# EAGLE design embededwebcam (EAGLE 8.5.2)
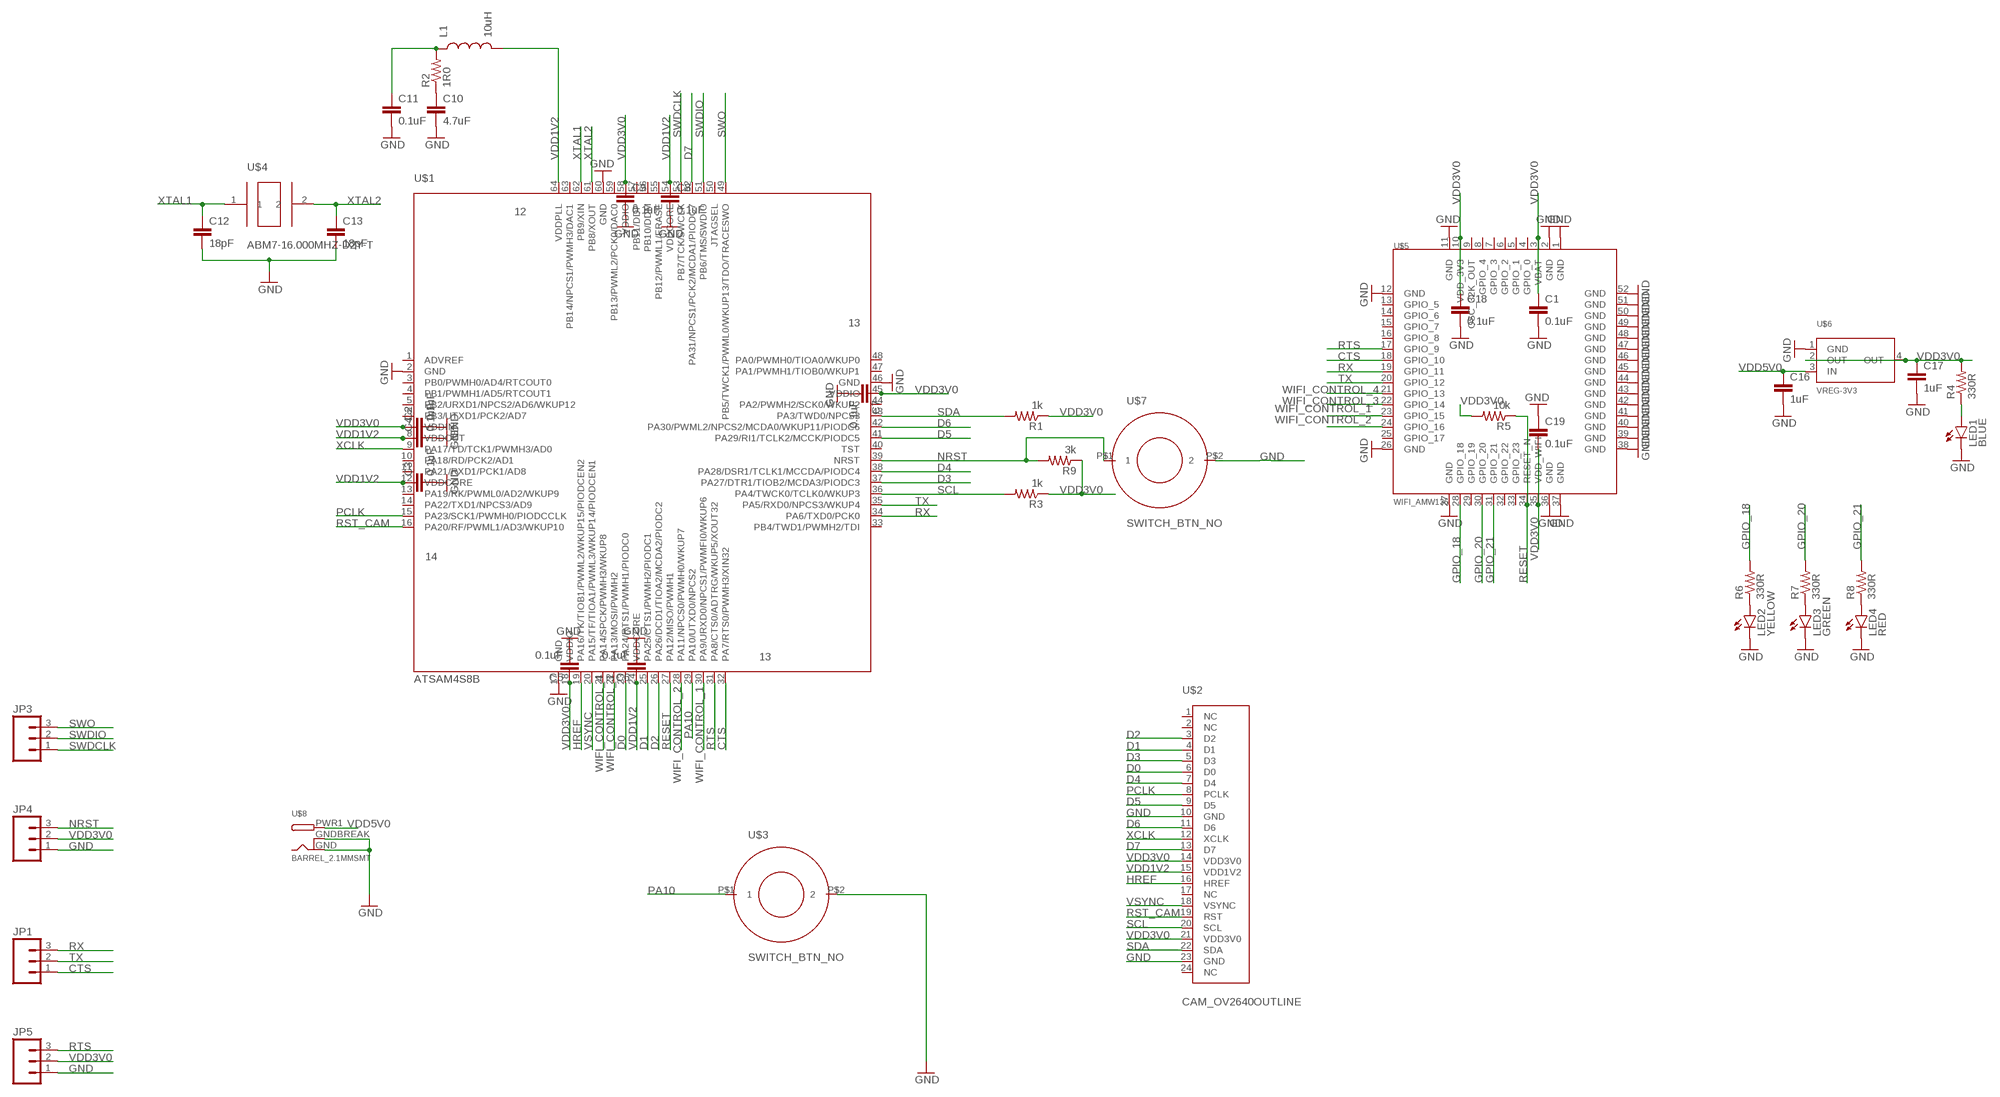
[diagram p0: schematic, sheet 1]

## Parts
C1  0.1uF  CAP  [0805]
C2  0.1uF  CAP0805  [0805]
C3  0.1uF  CAP0805  [0805]
C4  0.1uF  CAP0805  [0805]
C5  0.1uF  CAP0805  [0805]
C6  0.1uF  CAP0805  [0805]
C7  0.1uF  CAP0805  [0805]
C8  0.1uF  CAP0805  [0805]
C9  0.1uF  CAP0805  [0805]
C10  4.7uF  CAP0805  [0805]
C11  0.1uF  CAP0805  [0805]
C12  18pF  CAP0805  [0805]
C13  18pF  CAP0805  [0805]
C16  1uF  CAP  [0805]
C17  1uF  CAP  [0805]
C18  0.1uF  CAP  [0805]
C19  0.1uF  CAP  [0805]
JP1  M03PTH  [1X03]
JP3  M03PTH  [1X03]
JP4  M03PTH  [1X03]
JP5  M03PTH  [1X03]
L1  10uH  INDUCTOR0805  [0805]
LED1  BLUE  LED0603  [LED-0603]
LED2  YELLOW  LED0603  [LED-0603]
LED3  GREEN  LED0603  [LED-0603]
LED4  RED  LED0603  [LED-0603]
R1  1k  RESISTOR0805-RES  [0805]
R2  1R0  RESISTOR0805-RES  [0805]
R3  1k  RESISTOR0805-RES  [0805]
R4  330R  RES  [0805]
R5  10k  RES  [0805]
R6  330R  RES  [0805]
R7  330R  RES  [0805]
R8  330R  RES  [0805]
R9  3k  RESISTOR0805-RES  [0805]
U$1  ATSAM4S8B  [QFP50P1200X1200X160-64N]
U$2  CAM_OV2640OUTLINE  [CAM_CONN]
U$3  SWITCH_BTN_NO  [BTN_2]
U$4  ABM7-16.000MHZ-D2Y-T  [ABM7-16.000MHZ-D2Y-T]
U$5  WIFI_AMW136  [AMW136]
U$6  VREG-3V3  [R-PDSO-G4_TI]
U$7  SWITCH_BTN_NO  [BTN_2]
U$8  BARREL_2.1MMSMT  [DCJACK_2MM_SMT]

## Nets
CTS: JP1.1 U$1.32(PA7/RTS0/PWMH3/XIN32) U$5.18(GPIO_10)
D0: U$1.23(PA24/RTS1/PWMH1/PIODC0) U$2.6(D0)
D1: U$1.25(PA25/CTS1/PWMH2/PIODC1) U$2.4(D1)
D2: U$1.26(PA26/DCD1/TIOA2/MCDA2/PIODC2) U$2.3(D2)
D3: U$1.37(PA27/DTR1/TIOB2/MCDA3/PIODC3) U$2.5(D3)
D4: U$1.38(PA28/DSR1/TCLK1/MCCDA/PIODC4) U$2.7(D4)
D5: U$1.41(PA29/RI1/TCLK2/MCCK/PIODC5) U$2.9(D5)
D6: U$1.42(PA30/PWML2/NPCS2/MCDA0/WKUP11/PIODC6) U$2.11(D6)
D7: U$1.52(PA31/NPCS1/PCK2/MCDA1/PIODC7) U$2.13(D7)
GND: C1.2 C2.2 C3.2 C4.2 C5.2 C6.2 C7.2 C8.2 C9.2 C10.2 C11.2 C12.2 C13.2 C16.2 C17.2 C18.2 C19.1 JP4.1 JP5.1 LED1.C LED2.C LED3.C LED4.C U$1.2(GND) U$1.17(GND) U$1.46(GND) U$1.60(GND) U$2.10(GND) U$2.23(GND) U$3.P$2 U$5.1(GND) U$5.2(GND) U$5.11(GND) U$5.12(GND) U$5.26(GND) U$5.27(GND) U$5.36(GND) U$5.37(GND) U$5.38(GND) U$5.39(GND) U$5.40(GND) U$5.41(GND) U$5.42(GND) U$5.43(GND) U$5.44(GND) U$5.45(GND) U$5.46(GND) U$5.47(GND) U$5.48(GND) U$5.49(GND) U$5.50(GND) U$5.51(GND) U$5.52(GND) U$6.1(GND) U$7.P$2 U$8.GND U$8.GNDBREAK
GPIO_18: R6.2 U$5.28(GPIO_18)
GPIO_20: R7.2 U$5.30(GPIO_20)
GPIO_21: R8.2 U$5.31(GPIO_21)
HREF: U$1.19(PA16/TK/TIOB1/PWML2/WKUP15/PIODCEN2) U$2.16(HREF)
N$2: C11.1 L1.1 R2.2
N$3: C10.1 R2.1
N$4: LED1.A R4.1
N$46: LED2.A R6.1
N$52: LED3.A R7.1
N$53: LED4.A R8.1
NRST: JP4.3 R9.2 U$1.39(NRST) U$7.P$1
PA10: U$1.29(PA10/UTXD0/NPCS2) U$3.P$1
PCLK: U$1.15(PA23/SCK1/PWMH0/PIODCCLK) U$2.8(PCLK)
RESET: R5.1 U$1.27(PA12/MISO/PWMH1) U$5.34(RESET_N)
RST_CAM: U$1.16(PA20/RF/PWML1/AD3/WKUP10) U$2.19(RST)
RTS: JP5.3 U$1.31(PA8/CTS0/ADTRG/WKUP5/XOUT32) U$5.17(GPIO_9)
RX: JP1.3 U$1.34(PA6/TXD0/PCK0) U$5.19(GPIO_11)
SCL: R3.2 U$1.36(PA4/TWCK0/TCLK0/WKUP3) U$2.20(SCL)
SDA: R1.2 U$1.43(PA3/TWD0/NPCS3) U$2.22(SDA)
SWDCLK: JP3.1 U$1.53(PB7/TCK/SWCLK)
SWDIO: JP3.2 U$1.51(PB6/TMS/SWDIO)
SWO: JP3.3 U$1.49(PB5/TWCK1/PWML0/WKUP13/TDO/TRACESWO)
TX: JP1.2 U$1.35(PA5/RXD0/NPCS3/WKUP4) U$5.20(GPIO_12)
VDD1V2: C3.1 C4.1 C6.1 C8.1 L1.2 U$1.8(VDDOUT) U$1.12(VDDCORE) U$1.24(VDDCORE) U$1.54(VDDCORE) U$1.64(VDDPLL) U$2.15(VDD1V2)
VDD3V0: C1.1 C2.1 C5.1 C7.1 C9.1 C17.1 C18.1 C19.2 JP4.2 JP5.2 R1.1 R3.1 R4.2 R5.2 R9.1 U$1.7(VDDIN) U$1.18(VDDIO) U$1.45(VDDIO) U$1.58(VDDIO) U$2.14(VDD3V0) U$2.21(VDD3V0) U$5.3(VBAT) U$5.10(VDD_3V3) U$5.35(VDD_WIFI) U$6.2(OUT) U$6.4(OUT)
VDD5V0: C16.1 U$6.3(IN) U$8.PWR1(PWR)
VSYNC: U$1.20(PA15/TF/TIOA1/PWML3/WKUP14/PIODCEN1) U$2.18(VSYNC)
WIFI_CONTROL_1: U$1.30(PA9/URXD0/NPCS1/PWMFI0/WKUP6) U$5.24(GPIO_16)
WIFI_CONTROL_2: U$1.28(PA11/NPCS0/PWMH0/WKUP7) U$5.23(GPIO_15)
WIFI_CONTROL_3: U$1.22(PA13/MOSI/PWMH2) U$5.22(GPIO_14)
WIFI_CONTROL_4: U$1.21(PA14/SPCK/PWMH3/WKUP8) U$5.21(GPIO_13)
XCLK: U$1.9(PA17/TD/TCK1/PWMH3/AD0) U$2.12(XCLK)
XTAL1: C12.1 U$1.62(PB9/XIN) U$4.1
XTAL2: C13.1 U$1.61(PB8/XOUT) U$4.2
Unconnected: U$1.1(ADVREF) U$1.3(PB0/PWMH0/AD4/RTCOUT0) U$1.4(PB1/PWMH1/AD5/RTCOUT1) U$1.5(PB2/URXD1/NPCS2/AD6/WKUP12) U$1.6(PB3/UTXD1/PCK2/AD7) U$1.10(PA18/RD/PCK2/AD1) U$1.11(PA21/RXD1/PCK1/AD8) U$1.13(PA19/RK/PWML0/AD2/WKUP9) U$1.14(PA22/TXD1/NPCS3/AD9) U$1.33(PB4/TWD1/PWMH2/TDI) U$1.40(TST) U$1.44(PA2/PWMH2/SCK0/WKUP2) U$1.47(PA1/PWMH1/TIOB0/WKUP1) U$1.48(PA0/PWMH0/TIOA0/WKUP0) U$1.50(JTAGSEL) U$1.55(PB12/PWML1/ERASE) U$1.56(PB10/DDM) U$1.57(PB11/DDP) U$1.59(PB13/PWML2/PCK0/DAC0) U$1.63(PB14/NPCS1/PWMH3/DAC1) U$2.1(NC) U$2.2(NC) U$2.17(NC) U$2.24(NC) U$5.4(GPIO_0) U$5.5(GPIO_1) U$5.6(GPIO_2) U$5.7(GPIO_3) U$5.8(GPIO_4) U$5.9(OSC_32K_OUT) U$5.13(GPIO_5) U$5.14(GPIO_6) U$5.15(GPIO_7) U$5.16(GPIO_8) U$5.25(GPIO_17) U$5.29(GPIO_19) U$5.32(GPIO_22) U$5.33(GPIO_23)

## Notes on the sheet
- 12
- 13
- 14
- 13

## Library data of the parts
C1 C16-C19 = Ilya_Teach:CAP
C2-C13 = SparkFun:CAP: Capacitor Standard 0603 ceramic capacitor, and 0.1" leaded capacitor.
JP1 JP3-JP5 = SparkFun:M03: Header 3 Standard 3-pin 0.1" header. Use with straight break away headers (SKU : PRT-00116), right angle break away headers (PRT-00553), swiss pins (PRT-00743), machine pins (PRT-00117), and female headers (PRT-00115). Molex polarized connector foot print use with SKU : PRT-08232 with associated crimp pins and housings.
L1 = SparkFun:INDUCTOR: Inductors Basic Inductor/Choke - 0603 and 1206. Footprints are not proven and vary greatly between part numbers.
LED1-LED4 = Ilya_Teach:LED: LEDs Standard schematic elements and footprints for 5mm, 3mm, 1206, and 0603 sized LEDs. 5mm - Spark Fun Electronics SKU : COM-00529 (and others)
R1-R3 R9 = SparkFun:RESISTOR: Resistor Basic schematic elements and footprints for 0603, 1206, and PTH resistors.
R4-R8 = Ilya_Teach:RES
U$1 = Ilya:ATSAM4S8B
U$2 = Ilya_Teach:CAM_OV2640
U$3 U$7 = Ilya_Teach:SWITCH_BTN_NO
U$4 = Ilya:ABM7-16.000MHZ-D2Y-T
U$5 = Ilya_Teach:WIFI_AMW136
U$6 = Ilya_Teach:VREG-3V3
U$8 = Ilya_Teach:BARREL_2.1MM

## Board
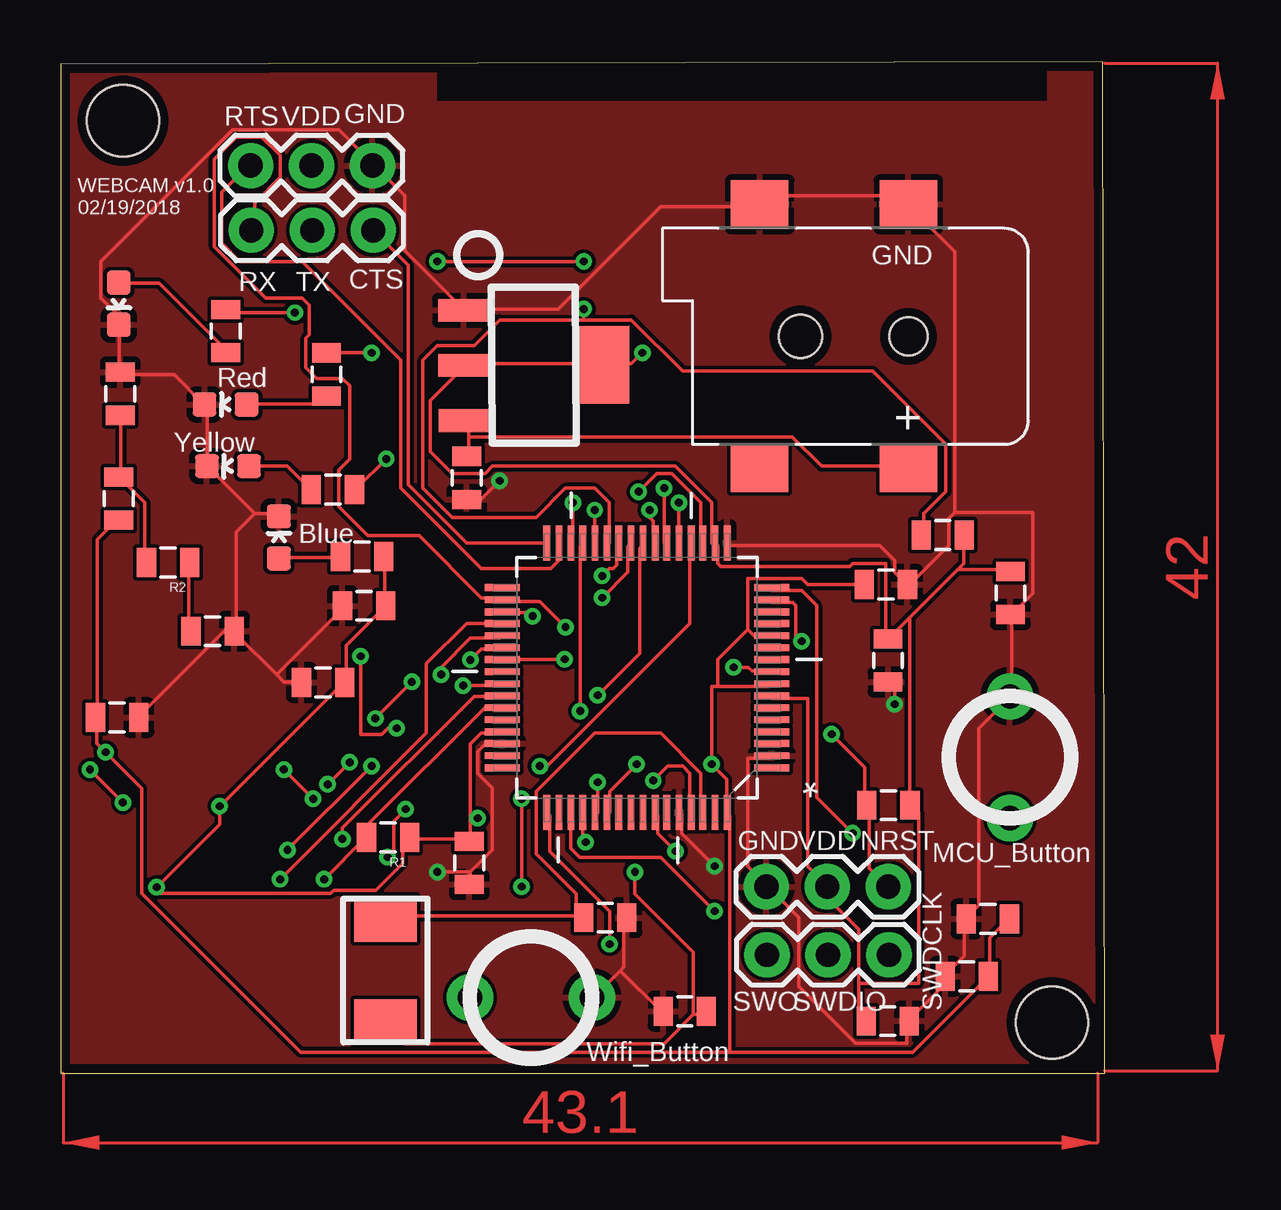
[diagram p1: board, top side]
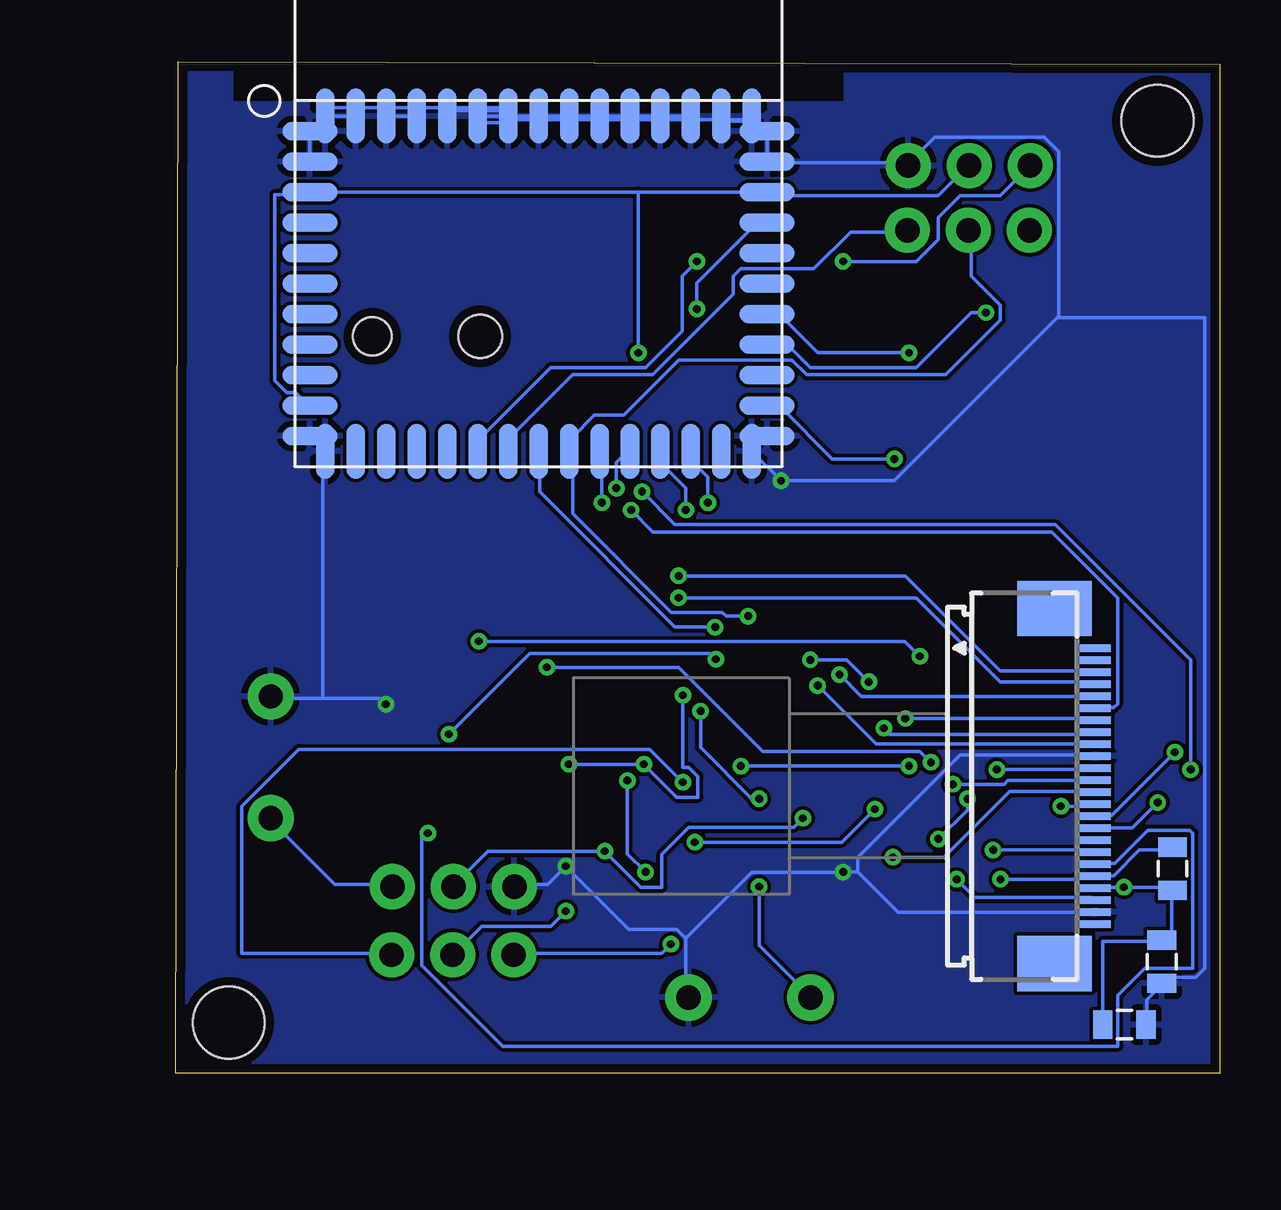
[diagram p2: board, bottom side, seen from below]

Size 43.51 x 42.16 mm. Coordinates in mm from the lower left corner, seen from the top.
Outline: 0,0 43.51,0 43.41,42.16 0,42.06 0,0
Copper layers (1*16): Top 0.0356mm / dielectric 1.5011mm / Bottom 0.0356mm
Design rules "LaenPCBOrder": minimum track width 6mil, minimum drill 13mil, track to track 6mil, track to pad 6mil, pad to pad 6mil, via to via 6mil, smd to smd 6mil, copper to edge 15mil, drill to drill 6mil, minimum pad ring 7mil, minimum via ring 7mil, stop-mask expansion 3mil, vias tented up to drill 0mil, thermal gap 10mil
Holes 3 mm at 2.6,39.7 41.3,2.1

### Footprints (pad centres in the part's own frame; a part is rotated, then mirrored left to right if it is on the bottom)
0805 = smd 0.8 x 1.2: 1 -0.9,0; 2 0.9,0
1X03 = drill 1.016 pad 1.88: 1 0,0; 2 2.54,0; 3 5.08,0
LED-0603 = smd 1 x 1: A 0,-0.877; C 0,0.877
QFP50P1200X1200X160-64N = smd 1.473 x 0.279: 1 -5.613,3.759; 2 -5.613,3.251; 3 -5.613,2.743; 4 -5.613,2.261; 5 -5.613,1.753; 6 -5.613,1.245; 7 -5.613,0.762; 8 -5.613,0.254; 9 -5.613,-0.254; 10 -5.613,-0.762; 11 -5.613,-1.245; 12 -5.613,-1.753; 13 -5.613,-2.261; 14 -5.613,-2.743; 15 -5.613,-3.251; 16 -5.613,-3.759; 33 5.613,-3.759; 34 5.613,-3.251; 35 5.613,-2.743; 36 5.613,-2.261; 37 5.613,-1.753; 38 5.613,-1.245; 39 5.613,-0.762; 40 5.613,-0.254; 41 5.613,0.254; 42 5.613,0.762; 43 5.613,1.245; 44 5.613,1.753; 45 5.613,2.261; 46 5.613,2.743; 47 5.613,3.251; 48 5.613,3.759 | smd 0.279 x 1.473: 17 -3.759,-5.613; 18 -3.251,-5.613; 19 -2.743,-5.613; 20 -2.261,-5.613; 21 -1.753,-5.613; 22 -1.245,-5.613; 23 -0.762,-5.613; 24 -0.254,-5.613; 25 0.254,-5.613; 26 0.762,-5.613; 27 1.245,-5.613; 28 1.753,-5.613; 29 2.261,-5.613; 30 2.743,-5.613; 31 3.251,-5.613; 32 3.759,-5.613; 49 3.759,5.613; 50 3.251,5.613; 51 2.743,5.613; 52 2.261,5.613; 53 1.753,5.613; 54 1.245,5.613; 55 0.762,5.613; 56 0.254,5.613; 57 -0.254,5.613; 58 -0.762,5.613; 59 -1.245,5.613; 60 -1.753,5.613; 61 -2.261,5.613; 62 -2.743,5.613; 63 -3.251,5.613; 64 -3.759,5.613
CAM_CONN = smd 0.3 x 1.3: 1 -5.75,3.25; 2 -5.25,3.25; 3 -4.75,3.25; 4 -4.25,3.25; 5 -3.75,3.25; 6 -3.25,3.25; 7 -2.75,3.25; 8 -2.25,3.25; 9 -1.75,3.25; 10 -1.25,3.25; 11 -0.75,3.25; 12 -0.25,3.25; 13 0.25,3.25; 14 0.75,3.25; 15 1.25,3.25; 16 1.75,3.25; 17 2.25,3.25; 18 2.75,3.25; 19 3.25,3.25; 20 3.75,3.25; 21 4.25,3.25; 22 4.75,3.25; 23 5.25,3.25; 24 5.75,3.25 | smd 2.3 x 3.1: P1 -7.4,1.55; P2 7.4,1.55
BTN_2 = drill 1.016 pad 1.93: P$1 -2.54,0; P$2 2.54,0
ABM7-16.000MHZ-D2Y-T = smd 1.9 x 2.6: 1 -2.15,0; 2 2.15,0
AMW136 = smd 0.762 x 2.286: 1 6.35,9.525; 2 5.08,9.525; 3 3.81,9.525; 4 2.54,9.525; 5 1.27,9.525; 6 0,9.525; 7 -1.27,9.525; 8 -2.54,9.525; 9 -3.81,9.525; 10 -5.08,9.525; 11 -6.35,9.525; 27 -6.35,-9.525; 28 -5.08,-9.525; 29 -3.81,-9.525; 30 -2.54,-9.525; 31 -1.27,-9.525; 32 0,-9.525; 33 1.27,-9.525; 34 2.54,-9.525; 35 3.81,-9.525; 36 5.08,-9.525; 37 6.35,-9.525 | smd 2.286 x 0.762: 12 -6.985,8.89; 13 -6.985,7.62; 14 -6.985,6.35; 15 -6.985,5.08; 16 -6.985,3.81; 17 -6.985,2.54; 18 -6.985,1.27; 19 -6.985,0; 20 -6.985,-1.27; 21 -6.985,-2.54; 22 -6.985,-3.81; 23 -6.985,-5.08; 24 -6.985,-6.35; 25 -6.985,-7.62; 26 -6.985,-8.89; 38 6.985,-8.89; 39 6.985,-7.62; 40 6.985,-6.35; 41 6.985,-5.08; 42 6.985,-3.81; 43 6.985,-2.54; 44 6.985,-1.27; 45 6.985,0; 46 6.985,1.27; 47 6.985,2.54; 48 6.985,3.81; 49 6.985,5.08; 50 6.985,6.35; 51 6.985,7.62; 52 6.985,8.89
R-PDSO-G4_TI = smd 0.95 x 2.15: 1 -2.3,-2.9; 2 0,-2.9; 3 2.3,-2.9 | smd 3.25 x 2.15: 4 0,2.9
DCJACK_2MM_SMT = smd 2.4 x 2: GND -2.54,-5.5; GNDBREAK 3.66,-5.5; PWR1 -2.54,5.5; PWR2 3.66,5.5 | hole 1.6: -2.54,0 | hole 1.8: 1.96,0

### Placement (x,y rotation side)
C1  34.47,17.2 270 top
C2  39.57,20.01 270 top
C3  34.38,20.37 0 top
C4  38.63,6.43 180 top
C5  34.46,2.17 0 top
C6  37.75,4.03 180 top
C7  12.64,19.48 180 top
C8  2.35,14.82 0 top
C9  17.02,8.76 270 top
C10  6.33,18.42 0 top
C11  2.48,28.32 90 top
C12  22.69,6.48 0 top
C13  26,2.58 180 top
C16  16.92,24.81 270 top
C17  3.98,2.02 0 bottom
C18  10.93,16.28 180 top
C19  2.42,4.64 90 bottom
JP1  13.02,35.13 180 top
JP3  34.51,4.93 180 top
JP4  29.4,7.77 0 top
JP5  12.99,37.83 180 top
L1  2.42,23.95 270 top
LED1  9.09,22.33 0 top
LED2  6.97,25.3 90 top
LED3  2.42,32.07 180 top
LED4  6.87,27.87 90 top
R1  13.64,9.82 180 top
R2  4.47,21.28 180 top
R3  1.98,8.52 90 bottom
R4  12.56,21.53 0 top
R5  36.75,22.43 0 top
R6  11.34,24.33 0 top
R7  6.87,30.93 90 top
R8  11.07,29.12 90 top
R9  34.49,11.17 180 top
U$1  24.01,16.48 180 top
U$2  8.45,11.96 270 bottom
U$3  19.6,3.15 0 top
U$4  13.53,4.28 270 top
U$5  28.39,32.91 90 bottom
U$6  19.71,29.51 270.2 top
U$7  39.55,13.16 90 top
U$8  32.78,30.71 180 top

### Tracks (layer width: path | path; a pad name or v marks a point on that pad's centre or on a via)
CTS
  Top 0.152: U$1.32 20.12,22.1 16.92,22.1 14.48,24.54 14.48,33.68 13.11,35.05 JP1.1
  Bottom 0.152: U$5.18 29.57,26.06 29.57,26.52 26.98,29.11 23.62,29.11 20.27,32.46 20.27,33.22 19.96,33.53 16.92,33.53 15.39,35.05 13.11,35.05 JP1.1
D0  (via drill 0.33)
  Top 0.152: v24.54,23.47 24.54,23.16 24.69,23.01 24.69,22.1 U$1.23
  Bottom 0.152: v24.54,23.47 23.62,22.55 7.01,22.55 4.27,19.81 4.27,15.39 4.42,15.24 5.18,15.24 U$2.6
D1  (via drill 0.33)
  Top 0.152: v22.55,19.81 23.62,20.88 23.62,21.95 U$1.25
  Bottom 0.152: v22.55,19.81 12.65,19.81 9.14,16.31 5.33,16.31 U$2.4
D2  (via drill 0.33)
  Top 0.152: v22.55,20.73 22.86,21.03 23.01,21.03 23.16,21.18 23.16,21.95 U$1.26
  Bottom 0.152: v22.55,20.73 13.11,20.73 9.14,16.76 5.33,16.76 U$2.3
D3  (via drill 0.33)
  Top 0.152: v15.85,16.61 15.85,16.92 17.07,18.14 18.29,18.14 U$1.37
  Bottom 0.152: v15.85,16.61 14.94,15.7 5.33,15.7 U$2.5
D4  (via drill 0.33)
  Top 0.152: v14.63,16.31 v13.11,14.78 | v17.07,17.22 17.53,17.68 18.29,17.68 U$1.38
  Bottom 0.152: v13.11,14.78 5.33,14.78 U$2.7 | v14.63,16.31 15.54,17.22 v17.07,17.22
D5  (via drill 0.33)
  Top 0.152: v16.76,16.15 18.29,16.15 U$1.41
  Bottom 0.152: v16.76,16.15 14.33,13.72 5.33,13.72 U$2.9
D6  (via drill 0.33)
  Top 0.152: v10.52,11.43 v9.3,12.65 | v11.73,9.75 11.73,10.21 17.22,15.7 18.29,15.7 U$1.42
  Bottom 0.152: v9.3,12.65 5.33,12.65 U$2.11 | v10.52,11.43 10.52,10.97 v11.73,9.75
D7  (via drill 0.33)
  Top 0.152: v13.62,9 13.88,9.25 13.88,10.5 v14.38,11 | v21.88,9.62 21.75,9.75 21.75,10.75 U$1.52
  Bottom 0.152: v13.62,9 11.5,9 8.75,11.75 5.25,11.75 U$2.13 | v14.38,11 15.75,9.62 v21.88,9.62
GND  (via drill 0.33)
  Top 0.152: 25.76,11.5 25.75,11.5 U$1.60 25.88,10.75 25.88,10 v27.25,8.62 | 17,23.88 C16.2 17.07,23.93 17.53,23.93 v18.29,24.69 | 23.32,4.27 22.25,3.2 U$3.P$2 | 23.32,4.27 23.47,4.42 23.47,6.4 C12.2 | 23.32,4.27 24.99,2.59 C13.2 | 17.07,8.38 17.07,7.92 C9.2 | 17.07,8.38 17.98,9.3 17.98,11.89 17.37,12.5 17.37,13.41 17.68,13.72 18.29,13.72 U$1.46 | v15.7,8.38 17.07,8.38 | 8.99,16.61 7.32,18.29 C10.2 | 8.99,16.61 9.3,16.31 9.91,16.31 C18.2 | 8.99,16.61 11.73,19.36 C7.2 | 8.08,23.32 8.99,23.32 LED1.C | 8.08,23.32 LED2.C 6.1,25.45 6.1,27.74 LED4.C 5.94,27.89 4.72,29.11 2.59,29.11 C11.2 2.44,29.26 2.44,31.09 LED3.C 2.29,31.24 2.29,31.7 1.68,32.31 1.68,33.83 7.16,39.32 11.58,39.32 12.95,37.95 JP5.1 13.11,37.8 14.33,36.58 14.33,34.29 16.76,31.85 U$6.1 16.92,31.85 20.73,31.85 24.99,36.12 29.11,36.12 U$8.GNDBREAK 29.26,36.27 30.02,36.27 30.33,36.58 34.9,36.58 35.2,36.27 U$8.GND 35.38,36.12 37.25,34.25 37.25,23.38 | 8.08,23.32 7.32,22.55 7.32,18.44 C10.2 | C8.2 3.25,14.88 7.25,18.88 C10.2 | U$1.2 29.5,13.12 28.62,13.12 28.62,8.62 29.38,7.88 JP4.1 29.5,7.75 30.75,6.5 30.75,3.62 33.12,1.25 35.25,1.25 35.25,2.12 C5.2 35.38,2.25 36.75,3.62 36.75,4 C6.2 36.88,4.12 37.64,4.88 37.64,6.4 C4.2 37.75,6.5 38.25,7 38.25,14.38 39.5,15.62 U$7.P$2 39.62,15.75 39.62,19 C2.2 39.62,19.12 40.5,20 40.5,23.38 37.25,23.38 | U$1.17 27.88,22 34.12,22 34.75,21.38 34.75,20.88 35.25,20.38 C3.2 35.38,20.38 37,22 37,23.12 37.25,23.38 | v34.75,15.38 34.75,16 34.5,16.25 C1.2
  Bottom 0.152: 19.31,39.69 19,39.38 18.88,39.38 U$5.37 U$5.36 18.75,37.95 13.11,37.95 JP5.1 12.95,37.95 11.89,39.01 7.32,39.01 6.71,38.41 6.71,31.55 | 19.31,39.69 19.5,39.88 | 19.5,39.88 19.62,39.75 22,39.75 | 29.5,39.75 29.62,39.75 29.75,39.62 31,39.62 31.12,39.75 31.12,40.12 | 29.5,39.75 22,39.75 | 31.12,40.12 29.62,40.12 29.62,40.25 33.12,40.25 | 33.12,40.25 37,40.25 37.25,40 U$5.52 | 19.5,39.88 U$5.38 | 29.5,7.75 JP4.1 29.38,7.88 28,7.88 v27.25,8.62 24.62,6 22.62,6 22.25,5.62 | U$5.11 37.88,26.5 37.38,26 U$5.12 37.38,25.88 37.38,15.62 | U$5.2 U$5.1 U$5.52 | U$5.52 U$5.51 | U$5.50 U$5.49 33.12,40.25 | U$5.48 31.97,40.12 31.12,40.12 | U$5.47 29.64,39.9 29.5,39.75 | U$5.46 U$5.45 U$5.44 U$5.43 U$5.42 U$5.41 U$5.40 22,39.75 | U$5.39 20.56,39.69 19.31,39.69 | U$5.27 U$5.26 19.51,25.91 v18.29,24.69 13.56,24.69 6.71,31.55 | C17.2 3.05,2.13 3.05,3.05 2.44,3.66 C19.1 2.38,3.75 2.12,4 1,4 0.62,4.38 0.62,31.5 6.75,31.5 6.71,31.55 | 15.09,8.38 13.41,6.71 5.33,6.71 U$2.23 | 15.09,8.38 15.09,8.99 10.82,13.26 5.33,13.26 U$2.10 | 15.09,8.38 v15.7,8.38 15.75,8.38 19.5,8.38 22.25,5.62 | 22.25,5.62 22.25,3.25 U$3.P$2 | v34.75,15.38 35,15.62 37.38,15.62 | 37.38,15.62 39.5,15.62 U$7.P$2
  pour Bottom: 0.1,0 43.6,0 43.7,-0.1 43.7,42 43.5,42.2 0.3,42.2 0.1,42
  pour Top: 0.3,41.9 0.3,-0.1 0,-0.4 42.9,-0.4 43.5,0.2 43.5,42.2 0.6,42.2
GPIO_18  (via drill 0.33)
  Top 0.152: v13.56,25.6 12.34,24.38 R6.2
  Bottom 0.152: v13.56,25.6 16.15,25.6 18.29,27.74 18.75,27.74 U$5.28
GPIO_20  (via drill 0.33)
  Top 0.152: v9.75,31.7 7.01,31.7 R7.2
  Bottom 0.152: v9.75,31.7 10.36,31.7 12.65,29.41 17.07,29.41 17.98,30.33 18.75,30.33 U$5.30
GPIO_21  (via drill 0.33)
  Top 0.152: v12.95,30.02 11.12,30.02 R8.2
  Bottom 0.152: v12.95,30.02 16.76,30.02 18.29,31.55 18.75,31.55 U$5.31
HREF  (via drill 0.33)
  Top 0.152: v1.22,12.65 v2.59,11.28 | v24.08,24.23 24.84,24.99 25.45,24.99 26.67,23.77 26.67,22.1 U$1.19
  Bottom 0.152: v2.59,11.28 3.66,10.21 5.18,10.21 U$2.16 | v1.22,12.65 1.22,17.22 6.86,22.86 22.71,22.86 v24.08,24.23
N$2
  Top 0.152: C11.1 2.5,27.25 2.5,25 L1.1 2.44,24.84 3.5,23.77 3.5,21.34 R2.2
N$3
  Top 0.152: R2.1 5.33,21.18 5.33,18.44 C10.1
N$4
  Top 0.152: LED1.A 9.14,21.49 11.58,21.49 R4.1
N$46
  Top 0.152: LED2.A 7.92,25.3 9.45,25.3 10.36,24.38 R6.1
N$52
  Top 0.152: LED3.A 2.44,32.92 4.12,32.92 6.86,30.18 R7.1
N$53
  Top 0.152: LED4.A 7.77,27.89 10.67,27.89 10.97,28.19 R8.1
NRST  (via drill 0.33)
  Top 0.152: JP4.3 34.44,7.77 33.68,8.53 33.68,11.12 R9.2 33.5,11.25 33.5,12.75 v32.12,14.12 | v21,17.25 18.5,17.25 U$1.39
  Bottom 0.152: v21,17.25 21.25,17.5 28.75,17.5 v32.12,14.12 | U$7.P$1 39.5,10.5 36.88,7.88 34.5,7.88 JP4.3
PA10  (via drill 0.33)
  Top 0.152: v21.64,15.09 21.64,21.95 U$1.29 | v19.2,7.77 v19.2,11.43
  Bottom 0.152: v21.64,15.09 21.64,13.56 19.51,11.43 v19.2,11.43 | v19.2,7.77 19.2,5.33 17.07,3.2 U$3.P$1
PCLK  (via drill 0.33)
  Top 0.152: v14,14.38 13.62,14.38 13.38,14.12 12.5,14.12 v12.5,17.38 | v30.88,18 30.62,18.25 30.62,19.5 30.5,19.62 29.62,19.62 U$1.15
  Bottom 0.152: v14,14.38 13.75,14.12 5.25,14.12 U$2.8 | v12.5,17.38 13.12,18 v30.88,18
RESET  (via drill 0.33)
  Top 0.152: 21.79,31.39 18.29,31.39 17.22,30.33 15.7,30.33 15.09,29.72 15.09,24.38 16.31,23.16 19.81,23.16 21.03,24.38 22.25,24.38 22.86,23.77 22.86,22.1 U$1.27 | 21.79,31.39 23.77,31.39 25.91,29.26 33.83,29.26 36.88,26.21 36.88,24.23 35.97,23.32 35.97,22.55 R5.1 | 21.79,31.39 v21.79,31.85
  Bottom 0.152: v21.79,31.85 21.79,32.92 19.36,35.36 18.9,35.36 U$5.34
RST_CAM  (via drill 0.33)
  Top 0.152: v33,10 31.5,11.5 31.5,19.5 30.88,20.12 29.62,20.12 U$1.16
  Bottom 0.152: v33,10 33.25,10 33.25,4.5 29.88,1.12 4.25,1.12 4.25,3.25 3.12,4.38 1.12,4.38 1.12,10 1.25,10.12 3,10.12 4.38,8.75 5.12,8.75 U$2.19
RTS  (via drill 0.33)
  Top 0.152: U$1.31 20.73,21.95 20.73,21.34 20.42,21.03 17.53,21.03 14.17,24.38 14.17,29.72 10.06,33.83 7.47,33.83 6.71,34.59 6.71,36.73 7.77,37.8 JP5.3 | v15.7,33.83 v21.79,33.83
  Bottom 0.152: v21.79,33.83 22.4,33.22 22.4,30.94 23.93,29.41 27.89,29.41 30.79,26.52 30.79,26.06 U$5.17 | v15.7,33.83 12.65,33.83 11.73,34.75 11.73,35.66 10.82,36.58 9.14,36.58 7.92,37.8 JP5.3
RX  (via drill 0.33)
  Top 0.152: v21.03,18.59 19.96,19.66 18.44,19.66 U$1.34 18.29,19.81 17.53,19.81 14.94,22.4 12.8,22.4 11.58,23.62 11.58,25.15 12.04,25.6 12.04,28.65 11.73,28.96 10.67,28.96 10.21,29.41 10.21,30.63 10.36,30.79 10.36,32 10.06,32.31 8.53,32.31 6.4,34.44 6.4,38.1 7.32,39.01 8.38,39.01 9.14,38.25 9.14,37.34 8.08,36.27 8.08,35.2 JP1.3
  Bottom 0.152: v21.03,18.59 22.71,18.59 28.35,24.23 28.35,25.91 U$5.19
SCL  (via drill 0.33)
  Top 0.152: v9.14,8.08 15.24,14.17 15.24,17.07 16.92,18.75 18.29,18.75 U$1.36
  Bottom 0.152: R3.2 1.98,9.3 3.35,9.3 4.42,8.23 5.18,8.23 U$2.20 5.33,8.23 5.94,8.23 6.1,8.08 v9.14,8.08
SDA  (via drill 0.33)
  Top 0.152: U$1.43 18.29,15.24 17.68,15.24 12.8,10.36 12.8,9.91 R1.2 12.65,9.75 v10.97,8.08
  Bottom 0.152: v10.97,8.08 10.21,7.32 5.33,7.32 U$2.22
SWDCLK  (via drill 0.33)
  Top 0.152: v22.38,12.12 22.38,10.88 U$1.53
  Bottom 0.152: v22.38,12.12 23.75,13.5 38.38,13.5 40.75,11.12 40.75,5 34.62,5 JP3.1
SWDIO  (via drill 0.33)
  Top 0.152: v27.25,6.75 25,9 21.62,9 21.25,9.38 21.25,10.75 U$1.51
  Bottom 0.152: v27.25,6.75 27.88,6.12 30.75,6.12 31.88,5 JP3.2
SWO  (via drill 0.33)
  Top 0.152: v22.88,5.38 22.88,6.75 20.38,9.25 20.38,10.75 U$1.49
  Bottom 0.152: v22.88,5.38 23.25,5 29.38,5 JP3.3
TX  (via drill 0.33)
  Top 0.152: v19.66,19.05 19.51,19.2 18.44,19.2 U$1.35
  Bottom 0.152: v19.66,19.05 20.57,19.05 20.73,19.2 22.86,19.2 26.98,23.32 26.98,25.91 U$5.20 26.98,26.06 26.98,26.52 26.06,27.43 24.84,27.43 22.55,29.72 17.83,29.72 17.22,29.11 11.43,29.11 9.14,31.39 9.14,32 10.36,33.22 10.36,35.05 JP1.2
VDD1V2  (via drill 0.33)
  Top 0.152: C4.1 39.47,6.4 38.71,5.64 38.71,4.12 C6.1 38.62,4 35.5,0.88 27.88,0.88 | L1.2 2.29,23.01 1.52,22.25 1.52,14.94 C8.1 1.5,14.75 1.5,13.75 v1.88,13.38 3.38,11.88 3.38,7.5 10,0.88 27.88,0.88 | 28.62,18.5 28.62,20.62 30.88,20.62 31.12,20.38 33.38,20.38 C3.1 | 28.62,18.5 28.88,18.25 29.5,18.25 U$1.12 | v24,12.88 22.88,11.75 22.88,10.88 U$1.54 | v22.38,15.75 24.12,17.5 24.12,21.88 24.25,22 U$1.24 | 27.38,16.12 27.12,16.12 v27.12,12.88 27.75,12.25 27.75,10.88 U$1.64 27.88,10.75 27.88,0.88 | 27.38,16.12 29.5,16.12 U$1.8 | 28.62,18.5 27.38,17.25 27.38,16.12
  Bottom 0.152: v1.88,13.38 4.5,10.75 5.12,10.75 U$2.15 | v27.12,12.88 v24,12.88 22.62,11.5 21.75,11.5 21.75,12.38 22.12,12.75 22.38,12.75 v22.38,15.75
VDD3V0  (via drill 0.33)
  Top 0.152: R4.2 13.5,21.5 13.5,19.5 C7.1 13.41,19.36 11.89,17.83 11.89,16.31 C18.1 11.75,16.25 v6.62,11.12 6.62,10.38 v4,7.75 4,7.5 11.25,7.5 11.38,7.62 13.12,7.62 14.25,8.75 14.25,9.5 14.5,9.75 R1.1 14.63,9.75 16.92,9.75 C9.1 17.07,9.75 17.07,10.62 | 33.25,3.75 33.25,6 32,7.25 32,7.75 JP4.2 31.88,7.88 31.12,8.62 31.12,15.62 29.62,15.62 U$1.7 | 33.25,3.75 33.25,2.5 33.5,2.25 C5.1 | 17.07,10.62 17.07,13.72 17.53,14.17 18.29,14.17 U$1.45 | v24.23,30.02 23.77,29.57 22.71,29.57 U$6.4 22.55,29.57 16.92,29.57 U$6.2 16.76,29.41 15.39,28.04 15.39,25.91 16.31,24.99 17.68,24.99 17.98,25.3 25.6,25.3 27.13,23.77 27.13,22.1 U$1.18 27.38,22 27.38,21.25 27.5,21.12 32.88,21.12 33,21.25 34.38,21.25 34.38,18.12 C1.1 34.5,18.12 35.38,19 | v25.62,9.25 24.88,10 24.88,10.75 U$1.58 | 37.38,21 37.62,21.25 37.62,22.38 R5.2 | 37.38,21 35.38,19 | 35.38,19 35.38,11.25 R9.1 35.5,11.12 35.75,10.88 35.75,3.75 33.25,3.75 | 37.38,21 39.5,21 C2.1 | v17.38,10.62 17.07,10.62
  Bottom 0.152: U$2.21 5,7.75 v4,7.75 2,7.75 R3.1 2,7.5 2,5.75 2.25,5.75 C19.2 2.5,5.5 4.88,5.5 4.88,2.12 C17.1 | JP5.2 10.52,37.8 11.73,36.58 18.75,36.58 U$5.35 18.9,36.73 24.23,36.73 | 24.23,36.73 37.8,36.73 U$5.3 38,36.62 39.38,36.62 39.38,28.88 38.88,28.38 38.5,28.38 38,27.88 U$5.10 | 24.23,36.73 v24.23,30.02 | v6.62,11.12 5.25,11.12 U$2.14 | JP4.2 31.88,7.88 30.5,9.25 v25.62,9.25 24.12,7.75 23.25,7.75 23.25,9.12 22.12,10.25 17.75,10.25 v17.38,10.62
VDD5V0
  Top 0.152: 17,26.52 17,27 U$6.3 | 17,26.52 17,25.75 C16.1 | 17,26.52 30.48,26.52 31.7,25.3 35.2,25.3 U$8.PWR1
VSYNC  (via drill 0.33)
  Top 0.152: v12.95,12.8 v9.45,9.3 | v19.96,12.8 20.27,12.8 26.21,18.75 26.21,21.95 U$1.20
  Bottom 0.152: v9.45,9.3 5.33,9.3 U$2.18 | v19.96,12.8 v12.95,12.8
WIFI_CONTROL_1  (via drill 0.33)
  Top 0.152: v21.34,23.77 21.34,22.1 U$1.30
  Bottom 0.152: v21.34,23.77 21.34,24.84 21.95,25.45 21.95,25.91 U$5.24
WIFI_CONTROL_2  (via drill 0.33)
  Top 0.152: v22.25,23.47 U$1.28
  Bottom 0.152: v22.25,23.47 22.25,24.38 23.16,25.3 23.16,25.91 U$5.23
WIFI_CONTROL_3  (via drill 0.33)
  Top 0.152: v25.15,24.38 25.15,22.1 U$1.22
  Bottom 0.152: v25.15,24.38 25.15,25.45 24.69,25.91 U$5.22
WIFI_CONTROL_4  (via drill 0.33)
  Top 0.152: v25.76,23.77 U$1.21
  Bottom 0.152: v25.76,23.77 25.76,25.91 U$5.21
XCLK  (via drill 0.33)
  Top 0.152: v12.04,12.95 v11.12,12.04 | v28.04,16.92 28.65,16.92 28.8,16.76 29.57,16.76 U$1.9
  Bottom 0.152: v11.12,12.04 8.99,12.04 8.84,12.19 5.33,12.19 U$2.12 | v12.04,12.95 12.5,13.41 19.05,13.41 22.55,16.92 v28.04,16.92
XTAL1
  Top 0.152: 21.49,6.55 13.56,6.55 U$4.1 | 21.49,6.55 21.64,6.55 C12.1 21.49,6.55 | 21.49,6.55 21.49,7.47 19.81,9.14 19.81,11.73 22.25,14.17 24.99,14.17 26.67,12.5 26.67,10.97 U$1.62
XTAL2  (via drill 0.33)
  Top 0.152: 26.36,2.44 26.82,2.44 C13.1 | 26.36,2.44 25.15,1.22 14.33,1.22 13.56,1.98 U$4.2 | v24.69,12.19 25.3,12.8 25.91,12.8 26.21,12.5 26.21,10.97 U$1.61 | v23.93,8.38 23.93,7.47 26.36,5.03 26.36,2.44
  Bottom 0.152: v24.69,12.19 24.69,9.14 v23.93,8.38
(copper drawn outside any net)
  shapes: Top area x2

### Text on the board
tPlace: RTS | VDD | GND | WEBCAM v1.0 / 02/19/2018 | RX | TX | CTS | Red | Yellow | Blue | GND | VDD | NRST | MCU_Button | SWO | SWDIO | SWDCLK | Wifi_Button